# EAGLE design Diagram (EAGLE 8.6.0)
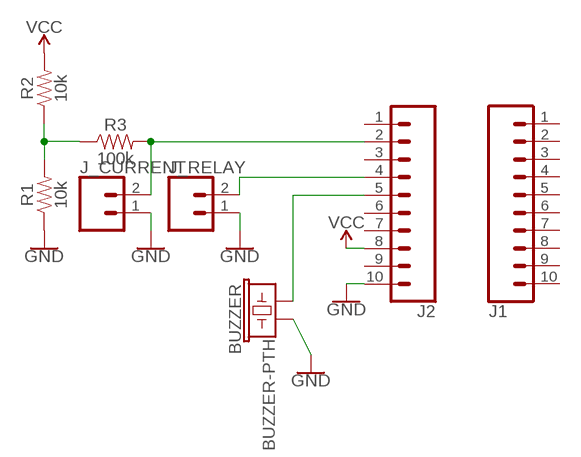
[diagram p0: schematic, sheet 1]

## Parts
BUZZER  BUZZER-PTH  [BUZZER-12MM]
J1  CONN_10"  [1X10]
J2  CONN_10"  [1X10]
J_CURRENT  CONN_02  [1X02]
J_RELAY  CONN_02  [1X02]
R1  10k  1KOHM-HORIZ-1/4W-1%  [AXIAL-0.3]
R2  10k  1KOHM-HORIZ-1/4W-1%  [AXIAL-0.3]
R3  100k  1KOHM-HORIZ-1/4W-1%  [AXIAL-0.3]

## Nets
A: J2.2 J_CURRENT.2 R3.P$2
GND: BUZZER.- J2.10 J_CURRENT.1 J_RELAY.1 R1.P$1
N$2: R1.P$2 R2.P$1 R3.P$1
N$3: J2.4 J_RELAY.2
PIN14: BUZZER.+ J2.5
VCC: J2.8 R2.P$2
Unconnected: J1.1 J1.2 J1.3 J1.4 J1.5 J1.6 J1.7 J1.8 J1.9 J1.10 J2.1 J2.3 J2.6 J2.7 J2.9

## Library data of the parts
BUZZER = SparkFun-Electromechanical:BUZZER: Buzzer Small round buzzers that operate around the audible 2kHz range. You can use these as speakers to create simple music or user interfaces. Variant Overview: PTH - Mini Speaker - PC Mount 12mm 2.048kHz <https://www.sparkfun.com/products/7950> PTH_KIT - Mini Speaker - PC Mount 12mm 2.048kHz <https://www.sparkfun.com/products/7950> KIT simplifies soldering by adding stop mask to one side of the pads. PTH_NO_SILK - Mini Speaker - PC Mount 12mm 2.048kHz <https://www.sparkfun.com/products/7950> No silkscreen indicator of buzzer outline. PTH_KIT_NO_SILK - Mini Speaker - PC Mount 12mm 2.048kHz <https://www.sparkfun.com/products/7950> KIT package w/o silkscreen SMD - Buzzer Audio Magnetic (CCV-084B16) SMD buzzer used on, e.g. the LilyPad Buzzer <https://www.sparkfun.com/products/8463> and RFID USB Reader <https://www.sparkfun.com/products/9963>. SMD_KIT - Buzzer Audio Magnetic (CCV-084B16) SMD Buzzer with elongated pins to make soldering easier. Used on the SparkFun Simon Says - Surface Mount Soldering Kit <https://www.sparkfun.com/products/10935>.; PROD_ID: COMP-08253; SF_SKU: COM-07950
J1 J2 = SparkFun-Connectors:CONN_10: Multi connection point. Often used as Generic Header-pin footprint for 0.1 inch spaced/style header connections On any of the 0.1 inch spaced packages, you can populate with these: Break Away Headers - Straight <https://www.sparkfun.com/products/116> (PRT-00116) Break Away Male Headers - Right Angle <https://www.sparkfun.com/products/553> (PRT-00553) Female Headers <https://www.sparkfun.com/products/115> (PRT-00115) Break Away Headers - Machine Pin <https://www.sparkfun.com/products/117> (PRT-00117) Break Away Female Headers - Swiss Machine Pin <https://www.sparkfun.com/products/743> (PRT-00743) Arduino Stackable Header - 10 Pin <https://www.sparkfun.com/products/11376> (PRT-11376) For SCREWTERMINALS and SPRING TERMINALS visit here: Screw Terimnals on SparkFun.com <https://www.sparkfun.com/search/results?term=Screw+Terminals> (5mm/3.5mm/2.54mm spacing) This device is also useful as a general connection point to wire up your design to another part of your project. Our various solder wires solder well into these plated through hole pads. Hook-Up Wire - Assortment (Stranded, 22 AWG) <https://www.sparkfun.com/products/11375> (PRT-11375) Hook-Up Wire - Assortment (Solid Core, 22 AWG) <https://www.sparkfun.com/products/11367> (PRT-11367) View the entire wire category on our website here <https://www.sparkfun.com/categories/141> Special notes: Molex polarized connector foot print use with SKU : PRT-08231 with associated crimp pins and housings. 1MM SMD Version SKU: PRT-10208 NOTES ON THE VARIANTS LOCK and LOCK_LONGPADS... This footprint was designed to help hold the alignment of a through-hole component (i.e. 6-pin header) while soldering it into place. You may notice that each hole has been shifted either up or down by 0.005 of an inch from it's more standard position (which is a perfectly straight line). This slight alteration caused the pins (the squares in the middle) to touch the edges of the holes. Because they are alternating, it causes a "brace" to hold the component in place. 0.005 has proven to be the perfect amount of "off-center" position when using our standard breakaway headers. Although looks a little odd when you look at the bare footprint, once you have a header in there, the alteration is very hard to notice. Also,if you push a header all the way into place, it is covered up entirely on the bottom side.; PROD_ID: CONN-11563
J_CURRENT J_RELAY = SparkFun-Connectors:CONN_02: Multi connection point. Often used as Generic Header-pin footprint for 0.1 inch spaced/style header connections On any of the 0.1 inch spaced packages, you can populate with these: Break Away Headers - Straight <https://www.sparkfun.com/products/116> (PRT-00116) Break Away Male Headers - Right Angle <https://www.sparkfun.com/products/553> (PRT-00553) Female Headers <https://www.sparkfun.com/products/115> (PRT-00115) Break Away Headers - Machine Pin <https://www.sparkfun.com/products/117> (PRT-00117) Break Away Female Headers - Swiss Machine Pin <https://www.sparkfun.com/products/743> (PRT-00743) For SCREWTERMINALS and SPRING TERMINALS visit here: Screw Terimnals on SparkFun.com <https://www.sparkfun.com/search/results?term=Screw+Terminals> (5mm/3.5mm/2.54mm spacing) This device is also useful as a general connection point to wire up your design to another part of your project. Our various solder wires solder well into these plated through hole pads. Hook-Up Wire - Assortment (Stranded, 22 AWG) <https://www.sparkfun.com/products/11375> (PRT-11375) Hook-Up Wire - Assortment (Solid Core, 22 AWG) <https://www.sparkfun.com/products/11367> (PRT-11367) View the entire wire category on our website here <https://www.sparkfun.com/categories/141> Special notes: Molex polarized connector foot print use with: PRT-08233 with associated crimp pins and housings. 2.54_SCREWTERM for use with PRT-10571. 3.5mm Screw Terminal footprints for PRT-08084 5mm Screw Terminal footprints for use with PRT-08432
R1-R3 = SparkFun-Resistors:1KOHM: 1kΩ resistor A resistor is a passive two-terminal electrical component that implements electrical resistance as a circuit element. Resistors act to reduce current flow, and, at the same time, act to lower voltage levels within circuits. - Wikipedia; PROD_ID: RES-12182; VALUE: 1k

## Net classes
1 lol: width 0.406 mm, drill 0.032 mm

## Board
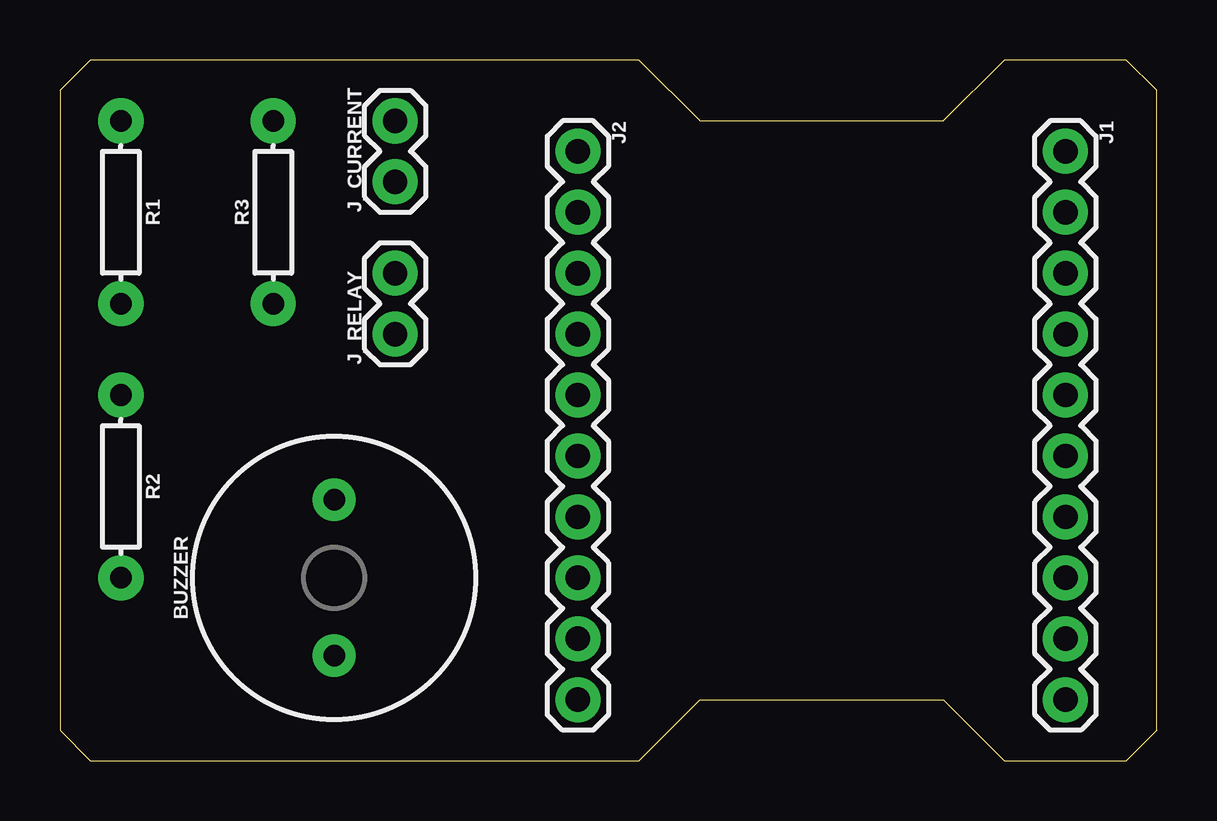
[diagram p1: board, top side]
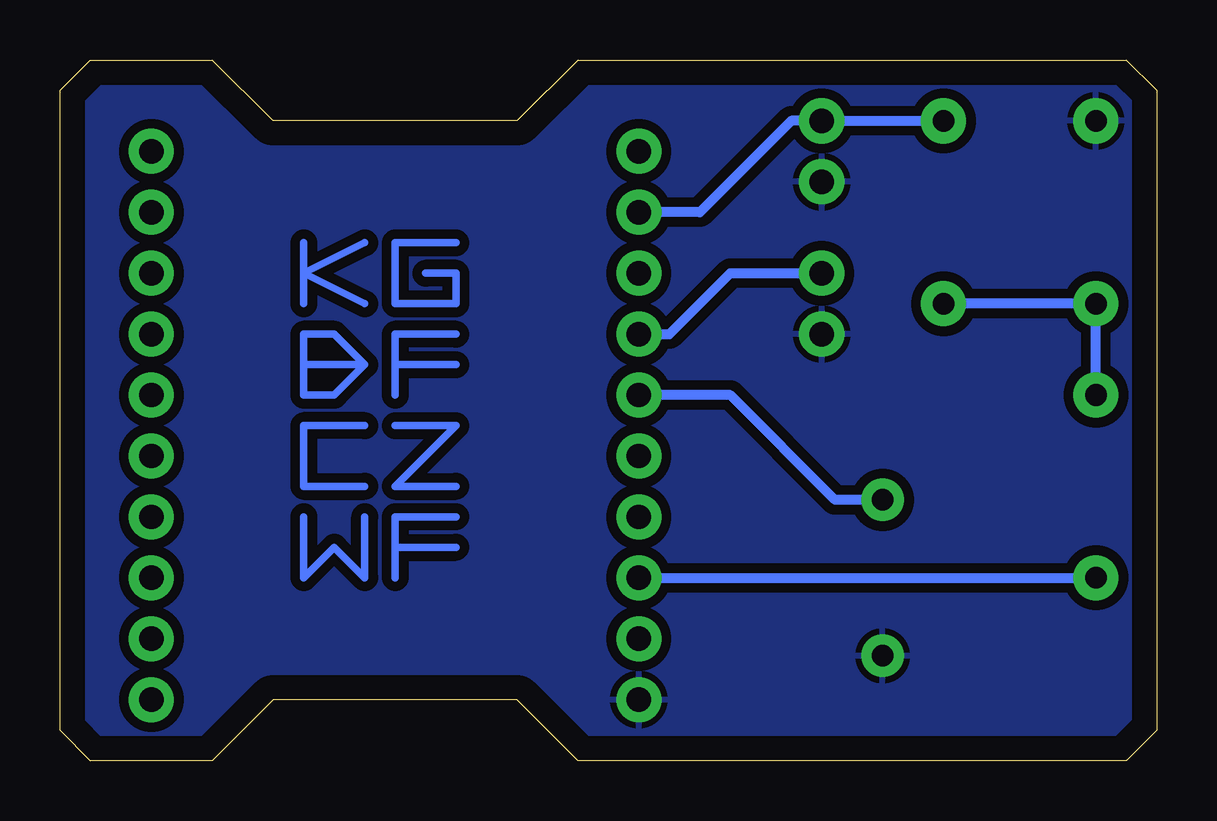
[diagram p2: board, bottom side, seen from below]

Size 45.72 x 29.21 mm. Coordinates in mm from the lower left corner, seen from the top.
Outline: 0,27.94 0,1.27 1.27,0 24.13,0 26.67,2.54 36.83,2.54 39.37,0 44.45,0 45.72,1.27 45.72,27.94 44.45,29.21 39.37,29.21 36.83,26.67 26.67,26.67 24.13,29.21 1.27,29.21 0,27.94
Copper layers (1*16): Top 0.035mm / dielectric 1.5mm / Bottom 0.035mm
Design rules "default": minimum track width 6mil, minimum drill 0.35mm, track to track 6mil, track to pad 6mil, pad to pad 6mil, via to via 6mil, smd to smd 6mil, copper to edge 40mil, drill to drill 6mil, minimum pad ring 10mil, minimum via ring 8mil, stop-mask expansion 4mil, vias tented up to drill 0mil, thermal gap 10mil

### Footprints (pad centres in the part's own frame; a part is rotated, then mirrored left to right if it is on the bottom)
BUZZER-12MM = drill 0.9 pad 1.778: + 3.25,0; - -3.25,0
1X10 = drill 1.016 pad 1.88: 1 0,0; 2 2.54,0; 3 5.08,0; 4 7.62,0; 5 10.16,0; 6 12.7,0; 7 15.24,0; 8 17.78,0; 9 20.32,0; 10 22.86,0
1X02 = drill 1.016 pad 1.88: 1 0,0; 2 2.54,0
AXIAL-0.3 = drill 0.9 pad 1.88: P$1 -3.81,0; P$2 3.81,0

### Placement (x,y rotation side)
BUZZER  11.43,7.62 90 top
J1  41.91,25.4 270 top
J2  21.59,25.4 270 top
J_CURRENT  13.97,24.13 90 top
J_RELAY  13.97,17.78 90 top
R1  2.54,22.86 270 top
R2  2.54,11.43 270 top
R3  8.89,22.86 90 top

### Tracks (layer width: path | path; a pad name or v marks a point on that pad's centre or on a via)
A
  Bottom 0.406: R3.P$2 J_CURRENT.2 15.24,26.67 19.05,22.86 J2.2
GND
  pour Bottom (isolate 0.406): -2.54,30.48 -2.54,-1.27 46.99,-1.27 46.99,30.48
N$1
  Bottom 0.305: 35.56,21.59 35.56,20.32 | 35.56,20.32 35.56,19.05 | 35.56,20.32 33.02,21.59 | 35.56,20.32 33.02,19.05
N$2
  Bottom 0.406: R2.P$1 R1.P$2 R3.P$1
N$3
  Bottom 0.406: J2.4 20.32,17.78 17.78,20.32 J_RELAY.2
N$4
  Bottom 0.305: 30.48,20.32 29.21,20.32 29.21,19.05 31.75,19.05 31.75,21.59 29.21,21.59
N$5
  Bottom 0.305: 35.56,16.51 35.56,17.78 34.29,17.78 33.02,16.51 | 35.56,16.51 35.56,15.24 34.29,15.24 33.02,16.51 | 35.56,16.51 33.02,16.51
N$6
  Bottom 0.305: 31.75,16.51 31.75,17.78 29.21,17.78 | 31.75,16.51 31.75,15.24 | 31.75,16.51 29.21,16.51
N$7
  Bottom 0.305: 33.02,13.97 35.56,13.97 35.56,11.43 33.02,11.43
N$8
  Bottom 0.305: 31.75,13.97 29.21,13.97 31.75,11.43 29.21,11.43
N$9
  Bottom 0.305: 35.56,10.16 35.56,7.62 34.29,8.89 33.02,7.62 33.02,10.16
N$10
  Bottom 0.305: 31.75,8.89 31.75,10.16 29.21,10.16 | 31.75,8.89 31.75,7.62 | 31.75,8.89 29.21,8.89
PIN14
  Bottom 0.406: BUZZER.+ 13.41,10.87 17.78,15.24 J2.5
VCC
  Bottom 0.406: J2.8 R2.P$2